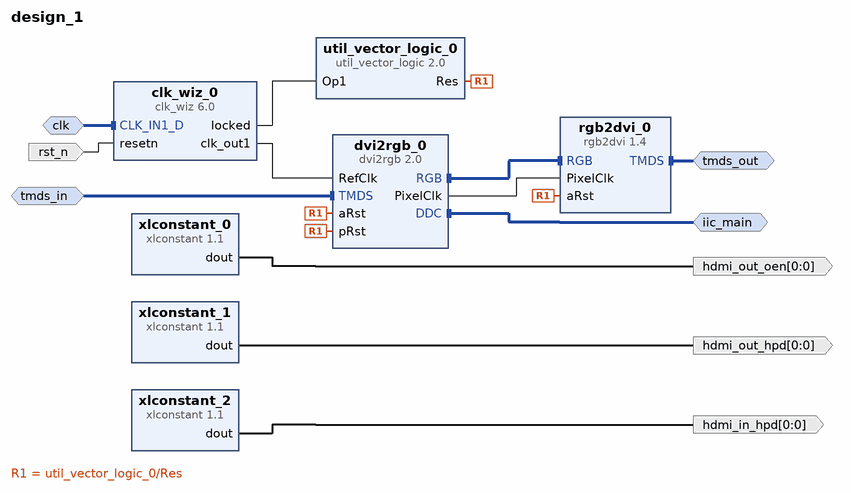
[diagram p0: block diagram of the top level]
# Vivado block design design_1, xc7z020clg484-1, Vivado 2023.2
create_bd_design design_1

create_bd_intf_port -mode Slave -vlnv digilentinc.com:interface:tmds_rtl:1.0 tmds_in
create_bd_intf_port -mode Master -vlnv digilentinc.com:interface:tmds_rtl:1.0 tmds_out
create_bd_intf_port -mode Slave -vlnv xilinx.com:interface:diff_clock_rtl:1.0 clk
create_bd_intf_port -mode Master -vlnv xilinx.com:interface:iic_rtl:1.0 iic_main
create_bd_port -dir I -type rst rst_n
create_bd_port -dir O -from 0 -to 0 hdmi_out_oen
create_bd_port -dir O -from 0 -to 0 hdmi_out_hpd
create_bd_port -dir O -from 0 -to 0 hdmi_in_hpd

create_bd_cell -type ip -vlnv digilentinc.com:ip:rgb2dvi:1.4 rgb2dvi_0
set_property -dict {CONFIG.kClkRange 2} [get_bd_cells rgb2dvi_0]
create_bd_cell -type ip -vlnv digilentinc.com:ip:dvi2rgb:2.0 dvi2rgb_0
set_property -dict {CONFIG.kClkRange 3} [get_bd_cells dvi2rgb_0]
create_bd_cell -type ip -vlnv xilinx.com:ip:clk_wiz:6.0 clk_wiz_0
set_property -dict [list \
  CONFIG.CLKIN1_JITTER_PS 50.0 \
  CONFIG.CLKOUT1_JITTER 98.146 \
  CONFIG.CLKOUT1_PHASE_ERROR 89.971 \
  CONFIG.CLKOUT1_REQUESTED_OUT_FREQ 200.000 \
  CONFIG.CLK_IN1_BOARD_INTERFACE sys_diff_clock \
  CONFIG.MMCM_CLKFBOUT_MULT_F 5.000 \
  CONFIG.MMCM_CLKIN1_PERIOD 5.000 \
  CONFIG.MMCM_CLKIN2_PERIOD 10.0 \
  CONFIG.MMCM_CLKOUT0_DIVIDE_F 5.000 \
  CONFIG.PRIM_SOURCE Differential_clock_capable_pin \
  CONFIG.RESET_PORT resetn \
  CONFIG.RESET_TYPE ACTIVE_LOW \
] [get_bd_cells clk_wiz_0]
create_bd_cell -type ip -vlnv xilinx.com:ip:util_vector_logic:2.0 util_vector_logic_0
set_property -dict {CONFIG.C_OPERATION not CONFIG.C_SIZE 1} [get_bd_cells util_vector_logic_0]
create_bd_cell -type ip -vlnv xilinx.com:ip:xlconstant:1.1 xlconstant_0
create_bd_cell -type ip -vlnv xilinx.com:ip:xlconstant:1.1 xlconstant_1
create_bd_cell -type ip -vlnv xilinx.com:ip:xlconstant:1.1 xlconstant_2

# ---- connections ----

connect_bd_intf_net -intf_net CLK_IN1_D_0_1 [get_bd_intf_ports clk] [get_bd_intf_pins clk_wiz_0/CLK_IN1_D]
connect_bd_intf_net -intf_net TMDS_0_1 [get_bd_intf_ports tmds_in] [get_bd_intf_pins dvi2rgb_0/TMDS]
connect_bd_intf_net [get_bd_intf_ports iic_main] [get_bd_intf_pins dvi2rgb_0/DDC]
connect_bd_intf_net [get_bd_intf_pins dvi2rgb_0/RGB] [get_bd_intf_pins rgb2dvi_0/RGB]
connect_bd_intf_net [get_bd_intf_ports tmds_out] [get_bd_intf_pins rgb2dvi_0/TMDS]
connect_bd_net [get_bd_pins clk_wiz_0/clk_out1] [get_bd_pins dvi2rgb_0/RefClk]
connect_bd_net [get_bd_pins clk_wiz_0/locked] [get_bd_pins util_vector_logic_0/Op1]
connect_bd_net [get_bd_pins dvi2rgb_0/PixelClk] [get_bd_pins rgb2dvi_0/PixelClk]
connect_bd_net -net resetn_0_1 [get_bd_ports rst_n] [get_bd_pins clk_wiz_0/resetn]
connect_bd_net [get_bd_pins util_vector_logic_0/Res] [get_bd_pins dvi2rgb_0/aRst] [get_bd_pins dvi2rgb_0/pRst] [get_bd_pins rgb2dvi_0/aRst]
connect_bd_net [get_bd_pins xlconstant_0/dout] [get_bd_ports hdmi_out_oen]
connect_bd_net [get_bd_pins xlconstant_1/dout] [get_bd_ports hdmi_out_hpd]
connect_bd_net [get_bd_pins xlconstant_2/dout] [get_bd_ports hdmi_in_hpd]

validate_bd_design
save_bd_design
